# EasyEDA Pro project bldc_driver_board_easyeda_2.eprj, board PCB4
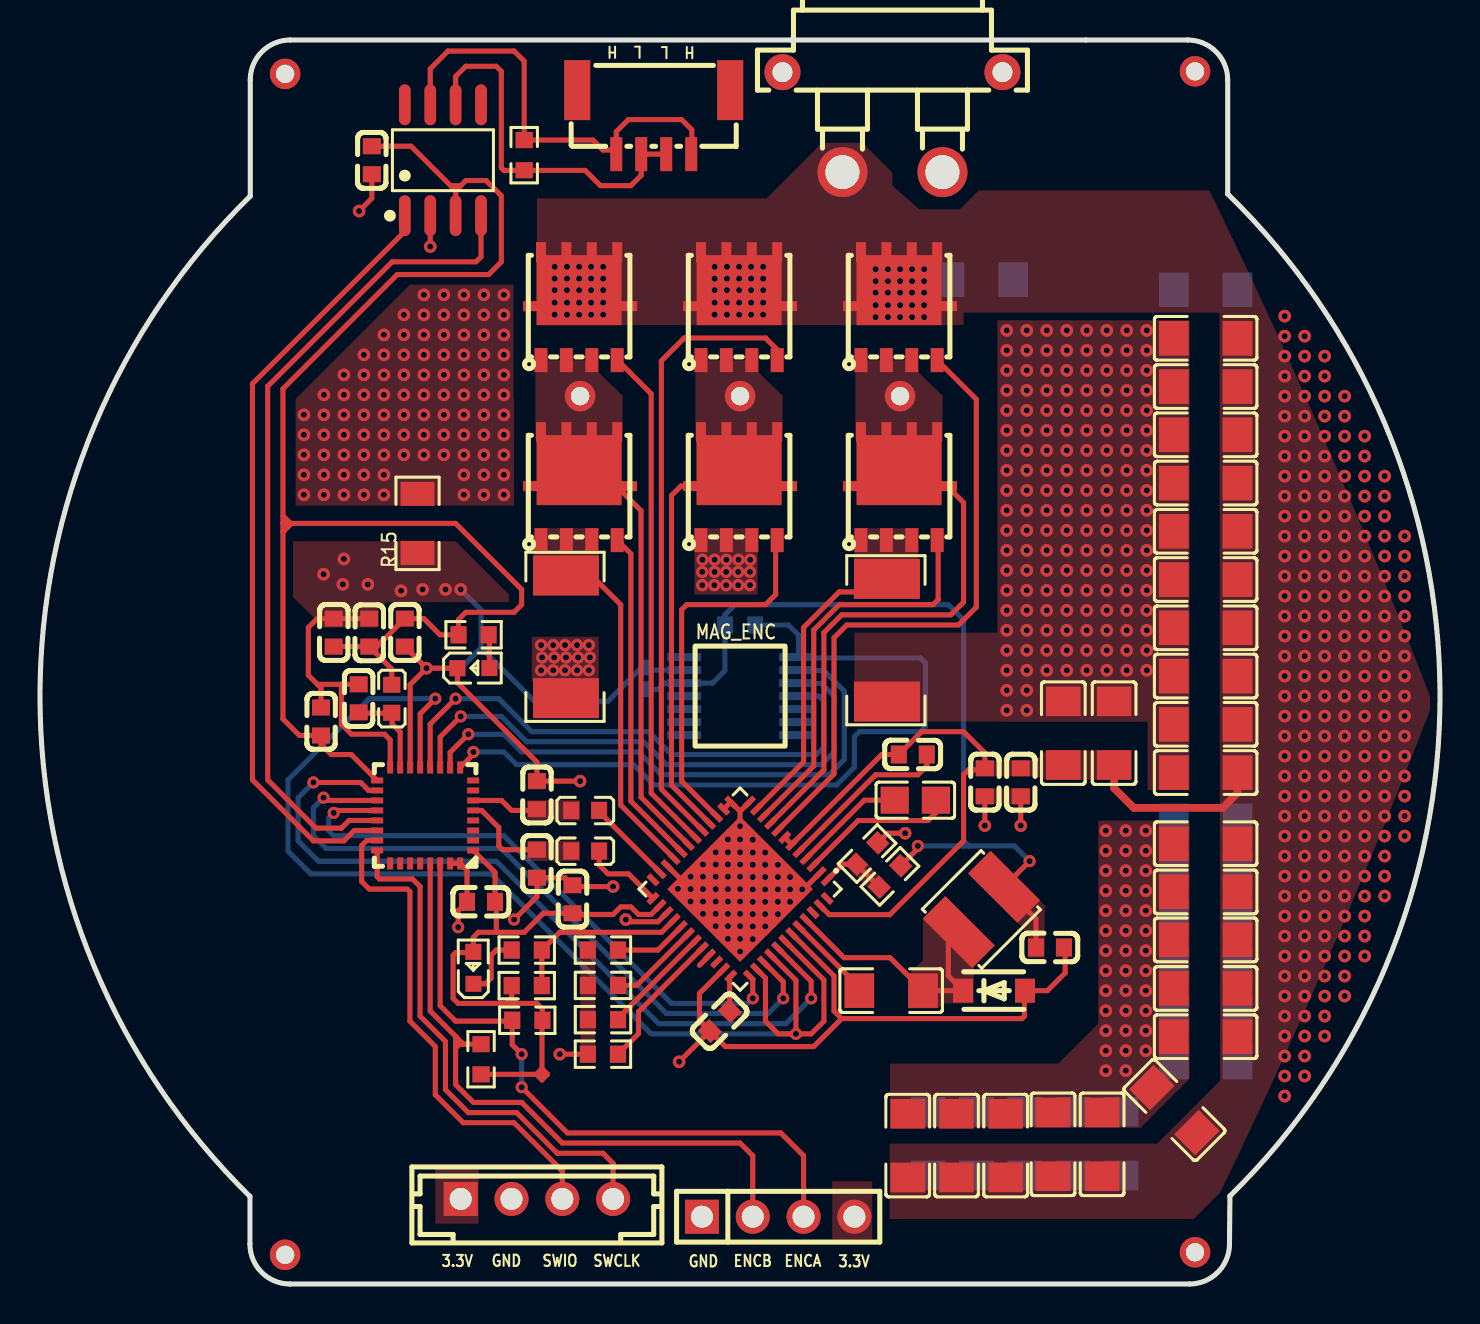
[diagram p1: board, top side]
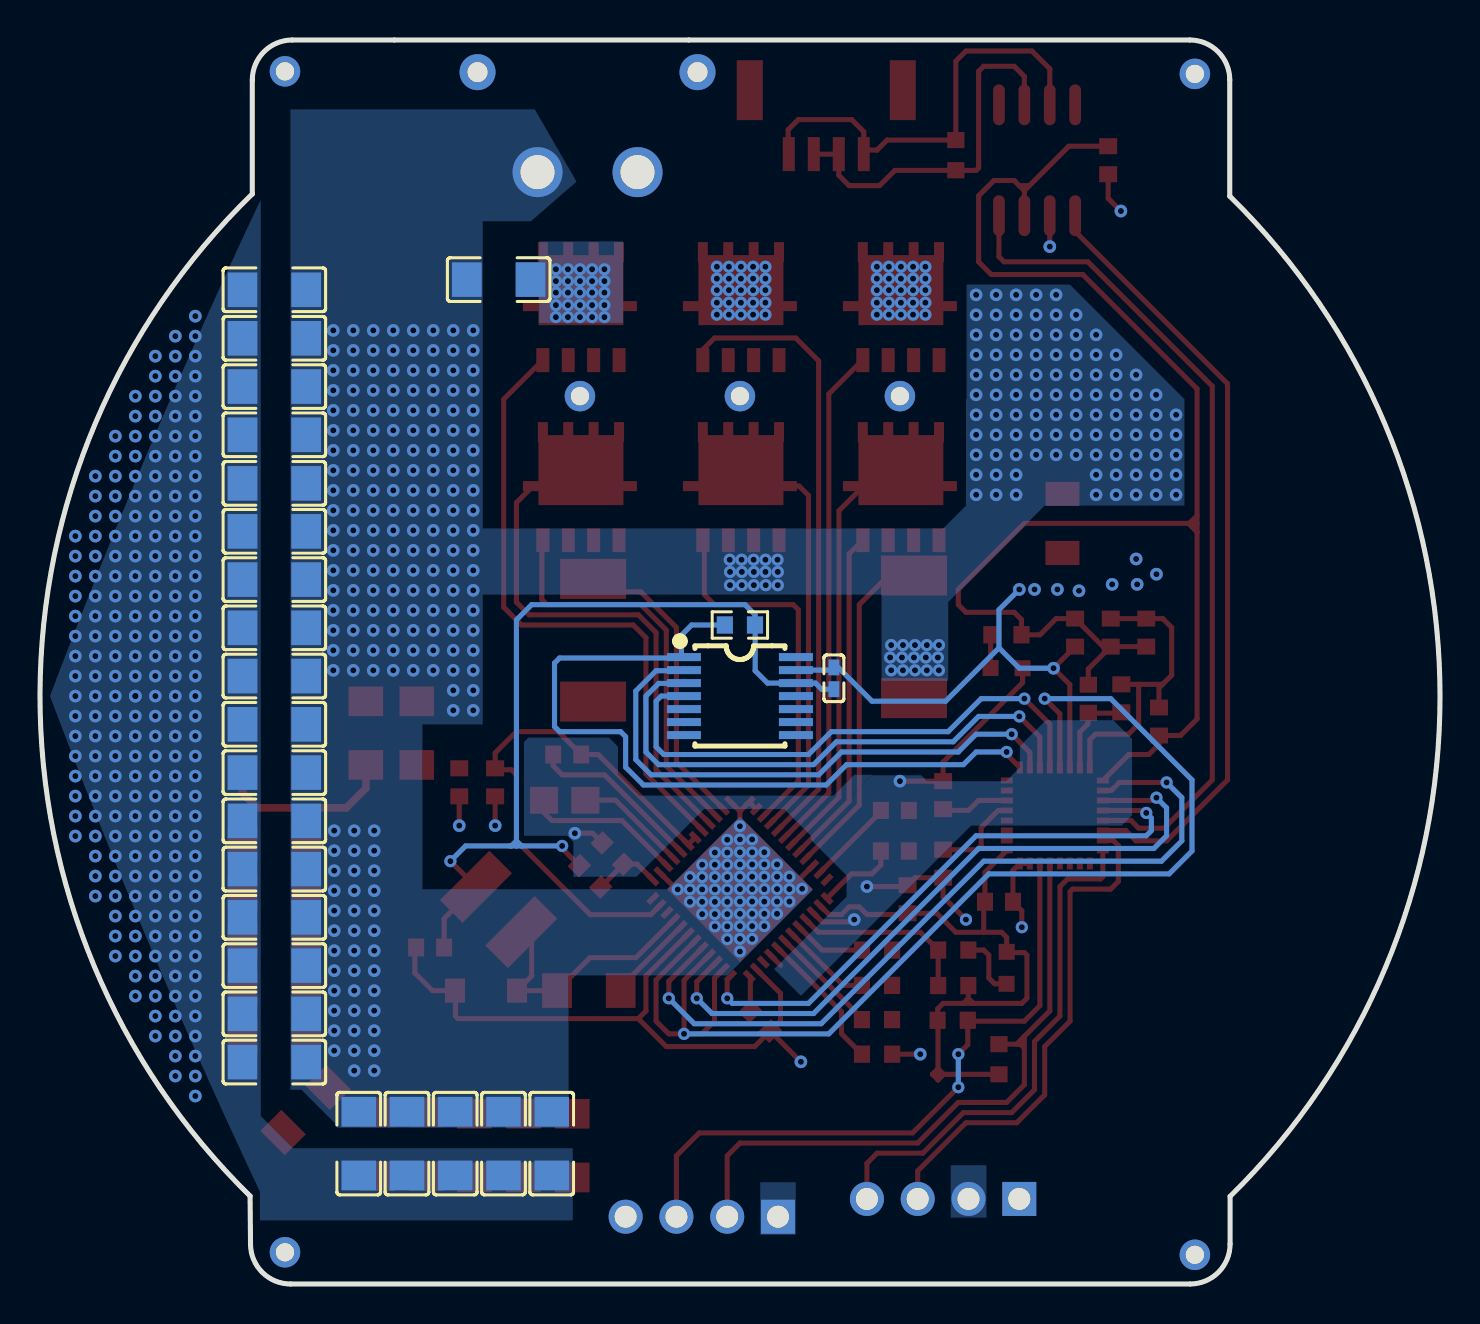
[diagram p2: board, bottom side, seen from below]

Outline 70.01 x 62.21 mm; copper layers: Top Layer, Bottom Layer. Coordinates in mm from the lower left corner of the outline.
Outline path: 10.5,4.38 10.5,2 arc(11.08,0.59) 12.5,0 57.48,0 arc(58.9,0.59) 59.48,2 59.5,4.4 arc(70.01,29.48) 59.39,54.51 59.39,60.21 arc(58.81,61.62) 57.39,62.21 12.51,62.21 arc(11.1,61.62) 10.51,60.21 10.51,54.4 arc(0,29.39) 10.5,4.38
Stack: Top Layer 0.035mm / Dielectric1 1.51mm FR4 er 4.5 / Bottom Layer 0.035mm

## Design rules (mm)
template: JLCPCB Capability(Two Layers Board)
spacing copperThickness1oz (default): track to track 0.102, other pairs 0.152 to 0.3
spacing copperThickness2oz: track to track 0.203, other pairs 0.152 to 0.3
track width copperThickness1oz (default): min 0.127, default 0.254, max 2.54
track width copperThickness2oz: min 0.203, default 0.254, max 2.54
differential pair differentialPair (default): width min 0.127, default 0.254, max 2.54; gap min 0.152, default 0.152
via viaSize (default): diameter min 0.5, default 0.61, max 10; hole min 0.3, default 0.305, max 6.3

## Placement (name value [footprint] x y rotation side)
C1  100nF  [C0603]  22.05 19.11 0 top
C2  100nF  [C0603]  14.05 28.13 270 top
C5  47nF  [C0805]  43.77 24.19 0 top
C6  10uF  [C1206]  53.71 27.55 90 top
C7  100nF  [C1206]  51.17 27.55 90 top
C8  1uF  [C0603]  43.64 26.48 0 top
C9  100nF  [C0603]  26.63 19.24 270 top
C10  1uF  [C0603]  33.99 13.14 45 top
C11  100nF  [C1206]  42.56 14.67 180 top
C12  22uF  [C0603]  50.5 16.83 0 top
C13  1uF  [C0603]  47.25 25.09 270 top
C14  1uF  [C0603]  49.04 25.09 270 top
C15  10uF  [C1206]  56.72 8.7 315 top
C16  10uF  [C1206]  58.29 44.88 0 bottom
C17  10uF  [C1206]  47.07 50.23 180 bottom
C18  10uF  [C1206]  46.83 7.02 270 bottom
C19  10uF  [C1206]  51.66 7.02 270 bottom
C20  10uF  [C1206]  43.39 6.92 270 top
C21  10uF  [C1206]  58.29 14.78 0 top
C22  10uF  [C1206]  58.29 47.29 0 top
C23  10uF  [C1206]  58.29 15.92 0 bottom
C24  10uF  [C1206]  58.29 18.34 0 bottom
C25  10uF  [C1206]  58.29 25.58 0 bottom
C26  10uF  [C1206]  58.29 27.99 0 bottom
C27  10uF  [C1206]  58.29 32.81 0 bottom
C28  10uF  [C1206]  58.29 37.64 0 bottom
C29  10uF  [C1206]  58.29 44.88 0 top
C30  10uF  [C1206]  58.29 40.05 0 top
C31  10uF  [C1206]  58.29 35.23 0 top
C32  10uF  [C1206]  58.29 30.4 0 top
C33  10uF  [C1206]  58.29 25.58 0 top
C34  10uF  [C1206]  58.29 19.61 0 top
C35  10uF  [C1206]  58.29 42.47 0 bottom
C36  10uF  [C1206]  58.29 47.29 0 bottom
C37  10uF  [C1206]  44.42 7.02 270 bottom
C38  10uF  [C1206]  49.24 7.02 270 bottom
C39  10uF  [C1206]  54.07 7.02 270 bottom
C40  10uF  [C1206]  58.29 49.72 0 bottom
C41  10uF  [C1206]  58.29 12.37 0 top
C42  10uF  [C1206]  58.29 11.1 0 bottom
C43  10uF  [C1206]  58.29 13.51 0 bottom
C44  10uF  [C1206]  58.29 20.75 0 bottom
C45  10uF  [C1206]  58.29 23.16 0 bottom
C46  10uF  [C1206]  58.29 30.4 0 bottom
C47  10uF  [C1206]  58.29 35.23 0 bottom
C48  10uF  [C1206]  58.29 40.04 0 bottom
C49  10uF  [C1206]  58.29 42.47 0 top
C50  10uF  [C1206]  58.29 37.64 0 top
C51  10uF  [C1206]  58.29 32.81 0 top
C52  10uF  [C1206]  58.29 27.99 0 top
C53  10uF  [C1206]  58.29 22.02 0 top
C54  10uF  [C1206]  58.29 17.21 0 top
C55  22uF  [C0603]  16.59 56.2 90 top
C56  220nF  [C0603]  14.69 32.58 270 top
C57  10nF  [C0603]  24.85 21.02 270 top
C58  10nF  [C0603]  24.85 24.45 270 top
C59  2.2uF  [C0402]  30.31 30.29 270 bottom
C60  10uF  [C1206]  48.29 6.92 270 top
C61  10uF  [C1206]  45.83 6.92 270 top
C62  10uF  [C1206]  53.11 6.99 270 top
C63  10uF  [C1206]  50.66 6.99 270 top
CN1  A1257WR-S-4P  [CONN-SMD_A1257WR-S-4P]  30.69 58.1 180 top
D1  MBR1H100SFT3G  [SOD-123F_L2.8-W1.8-LS3.7-RD]  47.71 14.67 0 top
H2  PZ254V-11-04P  [HDR-TH_4P-P2.54-V-M]  36.91 3.37 0 top
L2  100uH  [IND-SMD_L4.0-W4.0]  47.07 18.73 45 top
LED1  LTST-C191KRKT  [LED0603-RD]  21.67 30.8 0 top
LED2  LTST-C191KRKT  [LED0603-RD]  21.67 15.81 90 top
NOREF  -  [Pad_e1307]  57.76 60.64 0 top
NOREF#2  -  [Pad_e1308]  57.76 1.59 0 top
NOREF#3  -  [Pad_e128]  43.01 44.4 0 top
NOREF#4  -  [Pad_e1309]  12.26 1.46 0 top
NOREF#5  -  [Pad_e127]  35.01 44.4 0 top
NOREF#6  -  [Pad_e1306]  12.26 60.52 0 top
NOREF#7  -  [Pad_e126]  27.01 44.4 0 top
R1  10kΩ  [R0603]  35.01 32.96 0 bottom
R4  510Ω  [R0603]  21.68 32.47 180 top
R5  10mΩ  [RES-SMD_L6.4-W3.2-R2512]  42.35 32.19 90 top
R6  10mΩ  [RES-SMD_L6.4-W3.2-R2512]  26.3 32.36 90 top
R7  10kΩ  [R0603]  24.34 14.92 180 top
R8  330Ω  [R0603]  24.34 16.7 180 top
R9  47kΩ  [R0603]  28.15 16.7 180 top
R10  47kΩ  [R0603]  28.15 11.49 180 top
R11  75kΩ  [R0603]  28.15 13.22 180 top
R12  75kΩ  [R0603]  28.15 14.93 180 top
R13  33kΩ  [R0603]  42.5 20.38 225 top
R14  10kΩ  [R0603]  41.36 21.53 45 top
R15  0Ω  [R1206]  18.88 38.04 90 top
R16  60Ω  [R0603]  24.21 56.45 90 top
R17  10kΩ  [R0603]  24.37 13.19 180 top
R18  10kΩ  [R0603]  22.05 11.24 90 top
U1  STM32G491KEU6  [UFQFPN-32_L5.0-W5.0-P0.50-TL-1]  19.26 23.43 180 top
U2  DRV8323RHRGZR  [VQFN-48_L7.0-W7.0-P0.50-TL-EP5.1]  35.01 19.75 225 top
U3  TCAN332GD  [SOIC-8_L4.9-W3.9-P1.27-LS6.0-BL]  20.15 56.2 0 top
U4  TPH2R608NH,L1Q(M  [POWERVDFN-8_L5.0-W5.0-P1.27-LS6.0-BL]  43.01 48.9 0 top
U5  TPH2R608NH,L1Q(M  [POWERVDFN-8_L5.0-W5.0-P1.27-LS6.0-BL]  43.01 39.9 0 top
U6  TPH2R608NH,L1Q(M  [POWERVDFN-8_L5.0-W5.0-P1.27-LS6.0-BL]  35.01 48.9 0 top
U7  TPH2R608NH,L1Q(M  [POWERVDFN-8_L5.0-W5.0-P1.27-LS6.0-BL]  35.01 39.9 0 top
U8  TPH2R608NH,L1Q(M  [POWERVDFN-8_L5.0-W5.0-P1.27-LS6.0-BL]  27.01 48.9 0 top
U9  TPH2R608NH,L1Q(M  [POWERVDFN-8_L5.0-W5.0-P1.27-LS6.0-BL]  27.01 39.9 0 top
U10  100nF  [C0603]  15.94 29.29 90 top
U11  100nF  [C0603]  16.47 32.58 90 top
U12  100nF  [C0603]  18.24 32.58 270 top
U13  1uH  [L0603]  17.59 29.27 270 top
U14  1uH  [L0603]  27.26 21.65 180 top
U15  1uH  [L0603]  27.26 23.69 180 top
U18  AS5048A-HTSP-500  [TSSOP-14_L5.0-W4.4-P0.65-LS6.4-BL]  35.01 29.4 270 bottom
U19  XT30PW-F  [CONN-TH_XT30PW-F-1]  42.63 58.1 180 top
U20  B4B-EH-A(LF)(SN)  [CONN-TH_B4B-EH-A-LF-SN]  24.85 4.25 0 top

## Footprints (pads in the part's own frame, mm; a bottom-side part is the same pattern mirrored in y, then rotated)
C0402
  rect 0.79x0.54 smd: 1(-0.545,0) 2(0.545,0)
C0603
  rect 0.8x0.9 smd: 1(-0.7,0) 2(0.7,0)
C0805
  rect 1.41x1.35 smd: 1(-1.03,0) 2(1.03,0)
C1206
  rect 1.485x1.728 smd: 1(-1.593,0) 2(1.593,0)
CONN-SMD_A1257WR-S-4P
  rect 0.6x1.7 smd: 1(1.875,1.6) 2(0.625,1.6) 3(-0.625,1.6) 4(-1.875,1.6)
  rect 1.3x3 smd: 5(3.825,-1.6) 6(-3.825,-1.6)
CONN-TH_B4B-EH-A-LF-SN
  rect 1.7x1.7 hole 1.1: 1(-3.81,0)
  round 1.7 hole 1.1: 2(-1.27,0) 3(1.27,0) 4(3.81,0)
CONN-TH_XT30PW-F-1
  round 2.5 hole 1.7: 1(-2.5,2.5) 2(2.5,2.5)
  round 1.8 hole 1: 3(5.5,-2.5) 4(-5.5,-2.5)
HDR-TH_4P-P2.54-V-M
  rect 1.7x1.7 hole 1.1: 1(-3.81,0)
  round 1.7 hole 1.1: 2(-1.27,0) 3(1.27,0) 4(3.81,0)
IND-SMD_L4.0-W4.0
  rect 1.6x3.5 smd: 1(-1.6,0) 2(1.6,0)
L0603
  rect 0.8x0.864 smd: 1(-0.7,0) 2(0.7,0)
LED0603-RD
  rect 0.8x0.8 smd: 1(-0.799,-0.004) 2(0.799,0.004)
Pad_e126
  round 1.524 hole 0.914: 50(0,0)
Pad_e127
  round 1.524 hole 0.914: 51(0,0)
Pad_e128
  round 1.524 hole 0.914: 52(0,0)
Pad_e1306
  round 1.524 hole 0.914: 53(0,0)
Pad_e1307
  round 1.524 hole 0.914: 54(0,0)
Pad_e1308
  round 1.524 hole 0.914: 55(0,0)
Pad_e1309
  round 1.524 hole 0.914: 56(0,0)
POWERVDFN-8_L5.0-W5.0-P1.27-LS6.0-BL
  rect 0.65x1.2 smd: 1(-1.955,-2.7) 2(-0.685,-2.7) 3(0.585,-2.7) 4(1.855,-2.7)
  rect 0.5x1 smd: 5(1.855,2.7) 6(0.585,2.7) 7(-0.685,2.7) 8(-1.955,2.7)
  rect 1x0.5 smd: 8(-2.35,0.001) 8(2.35,0.001)
  rect 4.25x3.5 smd: 8(-0.05,0.8)
R0603
  rect 0.806x0.864 smd: 1(-0.753,0) 2(0.753,0)
R1206
  rect 1.208x1.701 smd: 1(-1.479,0) 2(1.479,0)
RES-SMD_L6.4-W3.2-R2512
  rect 2x3.3 smd: 1(-3.067,0) 2(3.067,0)
SOD-123F_L2.8-W1.8-LS3.7-RD
  rect 1x1.2 smd: 1(-1.55,0) 2(1.55,0)
SOIC-8_L4.9-W3.9-P1.27-LS6.0-BL
  oval 0.588x2.045 smd: 1(-1.905,-2.772) 2(-0.635,-2.772) 3(0.635,-2.772) 4(1.905,-2.772) 5(1.905,2.772) 6(0.635,2.772) 7(-0.635,2.772) 8(-1.905,2.772)
TSSOP-14_L5.0-W4.4-P0.65-LS6.4-BL
  rect 0.4x1.7 smd: 1(-1.95,-2.8) 2(-1.3,-2.8) 3(-0.65,-2.8) 4(0,-2.8) 5(0.65,-2.8) 6(1.3,-2.8) 7(1.95,-2.8) 8(1.95,2.8) 9(1.3,2.8) 10(0.65,2.8) 11(0,2.8) 12(-0.65,2.8) 13(-1.3,2.8) 14(-1.95,2.8)
UFQFPN-32_L5.0-W5.0-P0.50-TL-1
  rect 0.6x0.3 smd: 1(-2.4,1.75) 2(-2.4,1.25) 3(-2.4,0.75) 4(-2.4,0.25) 5(-2.4,-0.25) 6(-2.4,-0.75) 7(-2.4,-1.25) 8(-2.4,-1.75) 17(2.4,-1.75) 18(2.4,-1.25) 19(2.4,-0.75) 20(2.4,-0.25) 21(2.4,0.25) 22(2.4,0.75) 23(2.4,1.25) 24(2.4,1.75)
  rect 0.3x0.6 smd: 9(-1.75,-2.4) 10(-1.25,-2.4) 11(-0.75,-2.4) 12(-0.25,-2.4) 13(0.25,-2.4) 14(0.75,-2.4) 15(1.25,-2.4) 16(1.75,-2.4) 25(1.75,2.4) 26(1.25,2.4) 27(0.75,2.4) 28(0.25,2.4) 29(-0.25,2.4) 30(-0.75,2.4) 31(-1.25,2.4) 32(-1.75,2.4)
VQFN-48_L7.0-W7.0-P0.50-TL-EP5.1
  rect 0.665x0.28 smd: 1(-3.408,2.75) 2(-3.408,2.25) 3(-3.407,1.75) 4(-3.408,1.25) 5(-3.407,0.75) 6(-3.408,0.25) 7(-3.408,-0.25) 8(-3.407,-0.75) 9(-3.408,-1.25) 10(-3.407,-1.75) 11(-3.408,-2.25) 12(-3.408,-2.75) 25(3.408,-2.75) 26(3.408,-2.25) 27(3.407,-1.75) 28(3.408,-1.25) 29(3.407,-0.75) 30(3.408,-0.25) 31(3.408,0.25) 32(3.407,0.75) 33(3.408,1.25) 34(3.407,1.75) 35(3.408,2.25) 36(3.408,2.75)
  rect 0.28x0.665 smd: 13(-2.75,-3.408) 14(-2.25,-3.408) 15(-1.75,-3.407) 16(-1.25,-3.408) 17(-0.75,-3.407) 18(-0.25,-3.408) 19(0.25,-3.408) 20(0.75,-3.407) 21(1.25,-3.408) 22(1.75,-3.407) 23(2.25,-3.408) 24(2.75,-3.408) 37(2.75,3.408) 38(2.25,3.408) 39(1.75,3.407) 40(1.25,3.408) 41(0.75,3.407) 42(0.25,3.408) 43(-0.25,3.408) 44(-0.75,3.407) 45(-1.25,3.408) 46(-1.75,3.407) 47(-2.25,3.408) 48(-2.75,3.408)
  rect 5.15x5.15 smd: 49(0,0)

## Nets
As in the schematic, except:
BAT-: C6.2 C7.2 C15.1 C16.1 C17.1 C18.1 C19.1 C20.1 C21.1 C22.1 C23.1 C24.1 C25.1 C26.1 C27.1 C28.1 C29.1 C30.1 C31.1 C32.1 C33.1 C34.1 C35.1 C36.1 C37.1 C38.1 C39.1 C40.1 C41.1 C42.1 C43.1 C44.1 C45.1 C46.1 C47.1 C48.1 C49.1 C50.1 C51.1 C52.1 C53.1 C54.1 C60.1 C61.1 C62.1 C63.1 R5.1 R6.1 R15.2 U2.2 U2.12 U2.13 U2.14 U2.22 U2.49 U7.1 U7.2 U7.3 U19.1
PHASEA: NOREF#3.52 U2.9 U4.1 U4.2 U4.3 U5.5 U5.6 U5.7 U5.8
PHASEB: NOREF#5.51 U2.16 U6.1 U6.2 U6.3 U7.5 U7.6 U7.7 U7.8
PHASEC: NOREF#7.50 U2.19 U8.1 U8.2 U8.3 U9.5 U9.6 U9.7 U9.8

Pads without a net: CN1 5 6; NOREF 54; NOREF#2 55; NOREF#4 56; NOREF#6 53; U1 2 3 4 7 8 25 27 28; U2 46 48; U3 5 8; U18 5 6 7 8 9 10 11 14; U19 3 4

## Via types
v1: diameter 0.634, hole 0.305, Top Layer to Bottom Layer, 509 vias
v2: diameter 0.61, hole 0.305, Top Layer to Bottom Layer, 171 vias
v3: diameter 0.61, hole 0.3, Top Layer to Bottom Layer, 13 vias

## Routing (per net, layer and track width the routed paths; a pad name or vN(x,y) marks a point on that pad's centre or on a via; arc(x,y) is an arc through that point)
3.3V: length 156.6
  Top Layer w0.254: 12.15,38.42 12.53,38.04 12.58,38.04 12.15,37.6 12.15,37.59 ; 20.53,54.93 21.04,54.93 21.05,54.94 ; 23.59,14.29 23.84,14.03 23.87,14.03 ; 23.59,14.29 R7.2 ; 23.59,14.29 23.33,14.03 ; 24.77,10.49 24.82,10.49 ; 24.82,10.49 25.1,10.77 25.38,10.49 ; 24.82,10.49 25.1,10.21 25.1,10.21 25.38,10.49 ; 25.38,10.49 25.38,10.49 ; 20.78,54.67 U3.3 ; 20.78,54.67 18.56,56.9 C55.2 ; 20.78,54.67 21.29,55.18 22.31,55.18 23.07,54.42 23.07,51.12 22.43,50.48 17.86,50.48 12.15,44.77 12.15,38.04 ; U1.1 22.75,20.59 C1.2 22.82,19.05 22.82,17.59 ; U11.1 17.59,30.75 U13.1 ; U11.1 C56.2 ; U11.1 16.84,31.88 U12.1 19.19,33.28 20,32.47 R4.2 20.93,33.23 21.29,33.59 23.7,33.59 24.09,33.97 24.09,34.73 20.78,38.04 12.15,38.04 ; 33.48,16.46 33.48,16.44 32.98,15.94 ; 12.15,38.04 12.15,28.26 12.97,27.43 C2.2 14.05,26.99 14.56,26.48 15.56,26.48 U1.17 ; C12.1 49.8,18.27 L2.2 v2(49.49,21.15) ; 22.82,17.59 24.21,17.59 25.16,18.54 C9.2 26.69,18.48 28.66,18.48 29.04,18.86 29.55,18.86 29.93,18.48 30.56,18.48 U2.26 ; 22.82,17.59 21.92,17.59 21.67,17.34 LED2.2 21.63,16.57 20.78,16.57 20.66,16.45 20.66,14.29 20.91,14.03 23.33,14.03 ; R18.1 25.1,10.49 25.1,13.17 R17.1 25.12,13.76 24.85,14.03 23.33,14.03 ; v2(43.9,21.91) 43.9,21.78 R13.1
  Bottom Layer w0.254: 45.82,21.91 45.93,21.91 46.18,22.16 46.44,21.91 46.53,21.91 ; 46.18,21.91 46.18,21.91 46.18,33.21 45.42,33.97 34.75,33.97 34.25,33.47 R1.1 34.25,32.95 34.25,30.67 33.63,30.05 U18.12 31.23,30.05 30.92,29.74 C59.2 ; 46.18,21.91 48.72,21.91 v2(49.49,21.15) ; 46.18,21.91 v2(43.9,21.91)
3.3VA: length 4.6
  Top Layer w0.254: U1.15 18.01,27.6 17.61,28 17.61,28.55 ; 17.61,28.55 15.98,28.55 U10.1 ; 17.61,28.55 U13.2
24V: length 36.2
  Top Layer w0.254: U2.47 39.47,18.47 42.49,18.47 46.18,22.16 46.18,25.46 46.44,25.72 47.18,25.72 C13.1 47.25,26.56 46.18,27.62 44.09,27.62 C8.1 42.09,26.48 U2.6 U2.7
  Top Layer w0.381: C33.2 59.88,24.56 59.14,23.81 54.69,23.81 53.71,24.79 C6.1
  vias: v1(62.24,48.4) v1(62.24,47.4) v1(62.24,46.4) v1(62.24,45.4) v1(62.24,44.4) v1(62.24,43.4) v1(62.24,42.4) v1(62.24,41.4) v1(62.24,40.4) v1(62.24,39.4) v1(62.24,38.4) v1(62.24,37.4) v1(62.24,36.4) v1(62.24,35.4) v1(62.24,34.4) v1(62.24,33.4) v1(62.24,32.4) v1(62.24,31.4) v1(62.24,30.4) v1(62.24,29.4) v1(62.24,28.4) v1(62.24,27.4) v1(62.24,26.4) v1(62.24,25.4) v1(62.24,24.4) v1(62.24,23.4) v1(62.24,22.4) v1(62.24,21.4) v1(62.24,20.4) v1(62.24,19.4) v1(62.24,18.4) v1(62.24,17.4) v1(62.24,16.4) v1(62.24,15.4) v1(62.24,14.4) v1(62.24,13.4) v1(62.24,12.4) v1(62.24,11.4) v1(62.24,10.4) v1(62.24,9.4) v1(63.24,47.4) v1(63.24,46.4) v1(63.24,45.4) v1(63.24,44.4) v1(63.24,43.4) v1(63.24,42.4) v1(63.24,41.4) v1(63.24,40.4) v1(63.24,39.4) v1(63.24,38.4) v1(63.24,37.4) v1(63.24,36.4) v1(63.24,35.4) v1(63.24,34.4) v1(63.24,33.4) v1(63.24,32.4) v1(63.24,31.4) v1(63.24,30.4) v1(63.24,29.4) v1(63.24,28.4) v1(63.24,27.4) v1(63.24,26.4) v1(63.24,25.4) v1(63.24,24.4) v1(63.24,23.4) v1(63.24,22.4) v1(63.24,21.4) v1(63.24,20.4) v1(63.24,19.4) v1(63.24,18.4) v1(63.24,17.4) v1(63.24,16.4) v1(63.24,15.4) v1(63.24,14.4) v1(63.24,13.4) v1(63.24,12.4) v1(63.24,11.4) v1(63.24,10.4) v1(64.24,46.4) v1(64.24,45.4) v1(64.24,44.4) v1(64.24,43.4) v1(64.24,42.4) v1(64.24,41.4) v1(64.24,40.4) v1(64.24,39.4) v1(64.24,38.4) v1(64.24,37.4) v1(64.24,36.4) v1(64.24,35.4) v1(64.24,34.4) v1(64.24,33.4) v1(64.24,32.4) v1(64.24,31.4) v1(64.24,30.4) v1(64.24,29.4) v1(64.24,28.4) v1(64.24,27.4) v1(64.24,26.4) v1(64.24,25.4) v1(64.24,24.4) v1(64.24,23.4) v1(64.24,22.4) v1(64.24,21.4) v1(64.24,20.4) v1(64.24,19.4) v1(64.24,18.4) v1(64.24,17.4) v1(64.24,16.4) v1(64.24,15.4) v1(64.24,14.4) v1(64.24,13.4) v1(64.24,12.4) v1(65.24,44.4) v1(65.24,43.4) v1(65.24,42.4) v1(65.24,41.4) v1(65.24,40.4) v1(65.24,39.4) v1(65.24,38.4) v1(65.24,37.4) v1(65.24,36.4) v1(65.24,35.4) v1(65.24,34.4) v1(65.24,33.4) v1(65.24,32.4) v1(65.24,31.4) v1(65.24,30.4) v1(65.24,29.4) v1(65.24,29.4) v1(65.24,28.4) v1(65.24,27.4) v1(65.24,26.4) v1(65.24,25.4) v1(65.24,24.4) v1(65.24,23.4) v1(65.24,22.4) v1(65.24,21.4) v1(65.24,20.4) v1(65.24,19.4) v1(65.24,18.4) v1(65.24,17.4) v1(65.24,16.4) v1(65.24,15.4) v1(65.24,14.4) v1(66.24,42.4) v1(66.24,41.4) v1(66.24,40.4) v1(66.24,39.4) v1(66.24,38.4) v1(66.24,37.4) v1(66.24,36.4) v1(66.24,35.4) v1(66.24,34.4) v1(66.24,33.4) v1(66.24,32.4) v1(66.24,31.4) v1(66.24,30.4) v1(66.24,29.4) v1(66.24,28.4) v1(66.24,27.4) v1(66.24,26.4) v1(66.24,25.4) v1(66.24,24.4) v1(66.24,23.4) v1(66.24,22.4) v1(66.24,21.4) v1(66.24,20.4) v1(66.24,19.4) v1(66.24,18.4) v1(66.24,17.4) v1(66.24,16.4) v1(67.24,40.4) v1(67.24,39.4) v1(67.24,38.4) v1(67.24,37.4) v1(67.24,36.4) v1(67.24,35.4) v1(67.24,34.4) v1(67.24,33.4) v1(67.24,32.4) v1(67.24,31.4) v1(67.24,30.4) v1(67.24,29.4) v1(67.24,28.4) v1(67.24,27.4) v1(67.24,26.4) v1(67.24,25.4) v1(67.24,24.4) v1(67.24,23.4) v1(67.24,22.4) v1(67.24,21.4) v1(67.24,20.4) v1(67.24,19.4) v1(68.24,37.4) v1(68.24,36.4) v1(68.24,35.4) v1(68.24,34.4) v1(68.24,33.4) v1(68.24,32.4) v1(68.24,31.4) v1(68.24,30.4) v1(68.24,29.4) v1(68.24,28.4) v1(68.24,27.4) v1(68.24,26.4) v1(68.24,25.4) v1(68.24,24.4) v1(68.24,23.4) v1(68.24,22.4) v2(25.73,50.87) v2(25.73,50.28) v2(25.73,49.7) v2(25.73,49.07) v2(25.73,48.48) v2(26.35,50.87) v2(26.35,50.28) v2(26.35,49.7) v2(26.35,49.07) v2(26.35,48.48) v2(26.96,50.87) v2(26.96,50.28) v2(26.96,49.7) v2(26.96,49.07) v2(26.96,48.48) v2(27.56,50.87) v2(27.56,50.28) v2(27.56,49.7) v2(27.56,49.07) v2(27.56,48.48) v2(28.16,50.87) v2(28.16,50.28) v2(28.16,49.7) v2(28.16,49.07) v2(28.16,48.48) v2(33.73,50.87) v2(33.73,50.28) v2(33.73,49.7) v2(33.73,49.07) v2(33.73,48.48) v2(34.35,50.87) v2(34.35,50.28) v2(34.35,49.7) v2(34.35,49.07) v2(34.35,48.48) v2(34.96,50.87) v2(34.96,50.28) v2(34.96,49.7) v2(34.96,49.07) v2(34.96,48.48) v2(35.56,50.87) v2(35.56,50.28) v2(35.56,49.7) v2(35.56,49.07) v2(35.56,48.48) v2(36.16,50.87) v2(36.16,50.28) v2(36.16,49.7) v2(36.16,49.07) v2(36.16,48.48) v2(41.78,50.75) v2(41.78,50.15) v2(41.78,49.58) v2(41.78,48.95) v2(41.78,48.35) v2(42.4,50.75) v2(42.4,50.15) v2(42.4,49.58) v2(42.4,48.95) v2(42.4,48.35) v2(43.01,50.75) v2(43.01,50.15) v2(43.01,49.58) v2(43.01,48.95) v2(43.01,48.35) v2(43.61,50.75) v2(43.61,50.15) v2(43.61,49.58) v2(43.61,48.95) v2(43.61,48.35) v2(44.21,50.75) v2(44.21,50.15) v2(44.21,49.58) v2(44.21,48.95) v2(44.21,48.35)
DVDD: length 1.8
  Top Layer w0.254: 34.49,13.64 34.49,15.34 U2.36
GND: length 107.4
  Top Layer w0.254: v2(23.7,18.22) 24.85,19.37 C57.2 26.25,20.32 C9.1 26.69,19.88 v1(28.66,19.88) ; C55.1 16.59,54.29 v1(15.96,53.66) ; 33.5,12.65 32.98,13.17 32.98,14.53 U2.35 ; 33.5,12.65 34.27,11.87 38.69,11.87 40.09,13.27 ; 33.5,12.65 v1(31.96,11.11) ; 15.03,29.99 15.07,29.94 15.07,28 15.58,27.5 17.23,27.5 17.51,27.21 U1.16 ; 15.03,29.99 U10.2 ; 15.03,29.99 13.87,29.99 ; v1(43.26,22.54) 42.37,22.54 R14.2 ; 40.09,13.27 39.71,13.65 39.71,15.4 U2.43 ; 40.09,13.27 49.1,13.27 49.23,13.4 49.23,14.64 D1.2 50.37,14.67 51.26,15.56 51.26,16.77 C12.2 ; v1(27.01,25.15) C58.1 24.85,26.1 20.87,30.07 LED1.1 v1(19.33,30.79) ; C14.2 v1(49.04,22.92) ; v2(20.91,17.84) 20.91,18.67 C1.1 21.35,20.69 U1.32 U1.31 ; v1(19.51,51.88) U3.2 ; 13.87,29.99 14.05,29.81 C2.1 ; 13.87,29.99 13.42,30.44 13.42,32.83 13.86,33.28 C56.1 U11.2 ; v1(19.33,30.79) U12.2 ; v1(19.33,30.79) 18.51,29.98 U1.14 ; v1(29.29,18.22) 29.4,18.12 30.9,18.12 31.36,18.58 ; R10.2 v1(25.99,11.49) ; C13.2 v1(47.25,22.92)
  Bottom Layer w0.254: 22.05,31.81 21.03,30.79 v1(19.33,30.79) ; 22.05,31.81 24.72,29.15 28.4,29.15 30.09,30.83 C59.1 30.44,30.7 U18.13 ; 22.05,31.81 22.05,33.72 v1(21.04,34.73)
  vias: v1(14.18,35.5) v1(15.14,34.99) v1(15.2,36.26) v1(16.39,34.99) v1(18.05,34.67) v1(19.13,34.73) v1(20.28,34.73)
BAT-: length 10.9
  Top Layer w0.254: 38.13,19.75 38.19,19.75 38.93,20.49 ; U2.14 U2.13 35.01,23.64 ; U2.12 35.01,23.64 ; 35.01,23.64 v3(35.01,22.9) v3(35.01,22.23) v3(35.01,21.59) v3(35.01,20.98) v3(35.01,20.37) v3(35.01,19.75) v2(34.4,19.75) v2(33.79,19.75) v2(33.15,19.75) v2(32.53,19.75) 31.36,20.92
  vias: v1(13.2,43.47) v1(13.2,42.47) v1(13.2,41.47) v1(13.2,40.47) v1(13.2,39.47) v1(14.2,44.47) v1(14.2,43.47) v1(14.2,42.47) v1(14.2,41.47) v1(14.2,40.47) v1(14.2,39.47) v1(15.2,45.47) v1(15.2,44.47) v1(15.2,43.47) v1(15.2,42.47) v1(15.2,41.47) v1(15.2,40.47) v1(15.2,39.47) v1(16.2,46.47) v1(16.2,45.47) v1(16.2,44.47) v1(16.2,43.47) v1(16.2,42.47) v1(16.2,41.47) v1(16.2,40.47) v1(16.2,39.47) v1(17.2,47.47) v1(17.2,46.47) v1(17.2,45.47) v1(17.2,44.47) v1(17.2,43.47) v1(17.2,42.47) v1(17.2,41.47) v1(17.2,40.47) v1(17.2,39.47) v1(18.2,48.47) v1(18.2,47.47) v1(18.2,46.47) v1(18.2,45.47) v1(18.2,44.47) v1(18.2,43.47) v1(18.2,42.47) v1(18.2,41.47) v1(19.2,49.47) v1(19.2,48.47) v1(19.2,47.47) v1(19.2,46.47) v1(19.2,45.47) v1(19.2,44.47) v1(19.2,43.47) v1(19.2,42.47) v1(19.2,41.47) v1(20.2,49.47) v1(20.2,48.47) v1(20.2,47.47) v1(20.2,46.47) v1(20.2,45.47) v1(20.2,44.47) v1(20.2,43.47) v1(20.2,42.47) v1(20.2,41.47) v1(21.2,49.47) v1(21.2,48.47) v1(21.2,47.47) v1(21.2,46.47) v1(21.2,45.47) v1(21.2,44.47) v1(21.2,43.47) v1(21.2,42.47) v1(21.2,41.47) v1(21.2,40.47) v1(21.2,39.47) v1(22.2,49.47) v1(22.2,48.47) v1(22.2,47.47) v1(22.2,46.47) v1(22.2,45.47) v1(22.2,44.47) v1(22.2,43.47) v1(22.2,42.47) v1(22.2,41.47) v1(22.2,40.47) v1(22.2,39.47) v1(23.2,49.47) v1(23.2,48.47) v1(23.2,47.47) v1(23.2,46.47) v1(23.2,45.47) v1(23.2,44.47) v1(23.2,43.47) v1(23.2,42.47) v1(23.2,41.47) v1(23.2,40.47) v1(23.2,39.47) v1(48.34,47.69) v1(48.34,46.69) v1(48.34,45.69) v1(48.34,44.69) v1(48.34,43.69) v1(48.34,42.69) v1(48.34,41.69) v1(48.34,40.69) v1(48.34,39.69) v1(48.34,38.69) v1(48.34,37.69) v1(48.34,36.69) v1(48.34,35.69) v1(48.34,34.69) v1(48.34,33.69) v1(48.34,32.69) v1(48.34,31.69) v1(48.34,30.69) v1(48.34,29.69) v1(48.34,28.69) v1(49.34,47.69) v1(49.34,46.69) v1(49.34,45.69) v1(49.34,44.69) v1(49.34,43.69) v1(49.34,42.69) v1(49.34,41.69) v1(49.34,40.69) v1(49.34,39.69) v1(49.34,38.69) v1(49.34,37.69) v1(49.34,36.69) v1(49.34,35.69) v1(49.34,34.69) v1(49.34,33.69) v1(49.34,32.69) v1(49.34,31.69) v1(49.34,30.69) v1(49.34,29.69) v1(49.34,28.69) v1(50.34,47.69) v1(50.34,46.69) v1(50.34,45.69) v1(50.34,44.69) v1(50.34,43.69) v1(50.34,42.69) v1(50.34,41.69) v1(50.34,40.69) v1(50.34,39.69) v1(50.34,38.69) v1(50.34,37.69) v1(50.34,36.69) v1(50.34,35.69) v1(50.34,34.69) v1(50.34,33.69) v1(50.34,32.69) v1(50.34,31.69) v1(50.34,30.69) v1(51.34,47.69) v1(51.34,46.69) v1(51.34,45.69) v1(51.34,44.69) v1(51.34,43.69) v1(51.34,42.69) v1(51.34,41.69) v1(51.34,40.69) v1(51.34,39.69) v1(51.34,38.69) v1(51.34,37.69) v1(51.34,36.69) v1(51.34,35.69) v1(51.34,34.69) v1(51.34,33.69) v1(51.34,32.69) v1(51.34,31.69) v1(51.34,30.69) v1(52.34,47.69) v1(52.34,46.69) v1(52.34,45.69) v1(52.34,44.69) v1(52.34,43.69) v1(52.34,42.69) v1(52.34,41.69) v1(52.34,40.69) v1(52.34,39.69) v1(52.34,38.69) v1(52.34,37.69) v1(52.34,36.69) v1(52.34,35.69) v1(52.34,34.69) v1(52.34,33.69) v1(52.34,32.69) v1(52.34,31.69) v1(52.34,30.69) v1(53.34,47.69) v1(53.34,46.69) v1(53.34,45.69) v1(53.34,44.69) v1(53.34,43.69) v1(53.34,42.69) v1(53.34,41.69) v1(53.34,40.69) v1(53.34,39.69) v1(53.34,38.69) v1(53.34,37.69) v1(53.34,36.69) v1(53.34,35.69) v1(53.34,34.69) v1(53.34,33.69) v1(53.34,32.69) v1(53.34,31.69) v1(53.34,30.69) v1(53.3,22.67) v1(53.3,21.67) v1(53.3,20.67) v1(53.3,19.67) v1(53.3,18.67) v1(53.3,17.67) v1(53.3,16.67) v1(53.3,15.67) v1(53.3,14.67) v1(53.3,13.67) v1(53.3,12.67) v1(53.3,11.67) v1(53.3,10.67) v1(54.34,47.69) v1(54.34,46.69) v1(54.34,45.69) v1(54.34,44.69) v1(54.34,43.69) v1(54.34,42.69) v1(54.34,41.69) v1(54.34,40.69) v1(54.34,39.69) v1(54.34,38.69) v1(54.34,37.69) v1(54.34,36.69) v1(54.34,35.69) v1(54.34,34.69) v1(54.34,33.69) v1(54.34,32.69) v1(54.34,31.69) v1(54.34,30.69) v1(54.3,22.67) v1(54.3,21.67) v1(54.3,20.67) v1(54.3,19.67) v1(54.3,18.67) v1(54.3,17.67) v1(54.3,16.67) v1(54.3,15.67) v1(54.3,14.67) v1(54.3,13.67) v1(54.3,12.67) v1(54.3,11.67) v1(54.3,10.67) v1(55.34,47.69) v1(55.34,46.69) v1(55.34,45.69) v1(55.34,44.69) v1(55.34,43.69) v1(55.34,42.69) v1(55.34,41.69) v1(55.34,40.69) v1(55.34,39.69) v1(55.34,38.69) v1(55.34,37.69) v1(55.34,36.69) v1(55.34,35.69) v1(55.34,34.69) v1(55.34,33.69) v1(55.34,32.69) v1(55.34,31.69) v1(55.34,30.69) v1(55.3,22.67) v1(55.3,21.67) v1(55.3,20.67) v1(55.3,19.67) v1(55.3,18.67) v1(55.3,17.67) v1(55.3,16.67) v1(55.3,15.67) v1(55.3,14.67) v1(55.3,13.67) v1(55.3,12.67) v1(55.3,11.67) v2(25.06,31.95) v2(25.06,30.69) v2(25.11,31.33) v2(25.66,31.95) v2(25.71,31.33) v2(25.66,30.69) v2(26.25,31.95) v2(26.25,30.69) v2(26.3,31.33) v2(26.85,31.95) v2(26.85,30.69) v2(26.91,31.33) v2(27.45,31.95) v2(27.45,30.69) v2(27.5,31.33) v2(32.53,20.37) v2(32.53,19.12) v2(33.13,36.22) v2(33.11,35.61) v2(33.11,34.95) v2(33.15,20.98) v2(33.15,20.37) v2(33.15,19.12) v2(33.15,18.51) v2(33.73,36.22) v2(33.73,35.61) v2(33.72,34.95) v2(33.79,21.59) v2(33.79,20.98) v2(33.79,20.37) v2(33.79,19.12) v2(33.79,18.51) v2(33.79,17.9) v2(34.32,36.22) v2(34.31,35.61) v2(34.31,34.95) v2(34.4,22.23) v2(34.4,21.59) v2(34.4,20.98) v2(34.4,20.37) v2(34.4,19.12) v2(34.4,18.51) v2(34.4,17.9) v2(34.4,17.26) v2(34.93,36.22) v2(34.91,35.61) v2(34.91,34.95) v2(35.52,36.22) v2(35.5,35.61) v2(35.5,34.95) v2(35.64,22.22) v2(35.64,21.58) v2(35.64,20.97) v2(35.64,20.35) v2(35.64,19.73) v2(35.64,19.11) v2(35.64,18.5) v2(35.64,17.88) v2(35.64,17.25) v2(36.26,21.58) v2(36.26,20.97) v2(36.26,20.35) v2(36.26,19.73) v2(36.26,19.11) v2(36.26,18.5) v2(36.26,17.88) v2(36.9,20.97) v2(36.9,20.35) v2(36.9,19.73) v2(36.9,19.11) v2(36.9,18.5) v2(37.51,20.35) v2(37.51,19.73) v2(37.51,19.11) v3(31.9,19.76) v3(35.01,19.12) v3(35.01,18.51) v3(35.01,17.9) v3(35.01,17.26) v3(35.01,16.63) v3(38.12,19.73)
CANH: length 22.5
  Top Layer w0.254: U3.7 19.51,60.77 20.4,61.66 23.7,61.66 24.21,61.15 R16.2 27.65,57.2 28.15,56.71 28.61,56.71 CN1.1 28.82,57.62 29.42,58.23 32.09,58.23 32.59,57.72 32.59,56.53 CN1.4
CANL: length 18.7
  Top Layer w0.254: 24.2,55.69 R16.1 ; 24.2,55.69 27.26,55.69 28.02,54.93 29.55,54.93 30.07,55.45 CN1.2 CN1.3 ; 24.2,55.69 23.2,55.69 23.07,55.82 23.07,60.64 22.82,60.9 21.29,60.9 20.78,60.39 U3.6
CLK_MAG: length 28.3
  Top Layer w0.254: v2(21.42,27.5) 20.51,26.59 U1.10
  Bottom Layer w0.254: U18.2 37.84,30.67 39.2,30.67 40.21,29.65 40.21,26.23 39.45,25.46 31.07,25.46 29.93,26.61 24.09,26.61 23.2,27.5 v2(21.42,27.5)
CS_MAG: length 39.7
  Top Layer w0.254: v2(21.67,26.61) 21.67,26.49 U1.9
  Bottom Layer w0.254: v2(21.67,26.61) 23.2,26.61 23.83,25.97 29.67,25.97 30.69,24.96 39.83,24.96 40.72,25.84 40.72,27.37 40.98,27.62 44.02,27.62 44.28,27.88 44.28,31.05 44.02,31.31 37.85,31.31 U18.1 37.93,31.47 37.93,32.45 37.42,32.96 R1.2
ENABLE: length 61.1
  Top Layer w0.254: U1.13 19.01,28.52 v2(19.77,29.27) ; U2.42 39.2,15.2 39.2,13.14 38.56,12.51 v2(37.8,12.51) ; v2(37.8,12.51) 37.8,15.19 36.53,16.46 ; v2(37.8,12.51) 36.91,12.51 36.28,13.14 36.28,15.3 U2.38
  Bottom Layer w0.254: v2(37.8,12.51) 30.56,12.51 22.56,20.51 13.54,20.51 12.4,21.65 12.4,25.21 16.47,29.27 v2(19.77,29.27)
ENC_A: length 33.2
  Top Layer w0.254: v2(24.09,9.84) 26.37,7.56 37.04,7.56 38.18,6.41 H2.3 ; U1.30 20.01,13.92 20.78,13.14 23.57,13.14 R17.2 23.61,11.97 v2(24.09,11.49)
  Bottom Layer w0.254: v2(24.09,11.49) v2(24.09,9.84)
ENC_B: length 32.9
  Top Layer w0.254: 20.78,11.8 20.98,11.99 21.17,11.99 ; 21.17,11.99 20.79,12.38 ; 21.17,11.99 R18.2 ; 20.79,12.38 20.78,12.38 20.78,9.97 21.67,9.08 24.09,9.08 26.12,7.05 35.01,7.05 35.64,6.41 H2.2 ; 20.79,12.38 19.51,13.66 U1.29
FB: length 3.4
  Top Layer w0.254: U2.1 40.14,20.99 R14.1 R13.2
FDCAN_RX: length 41.7
  Top Layer w0.254: U1.21 15.45,23.18 15.07,22.8 13.8,22.8 11.39,25.21 11.39,44.89 17.61,51.12 21.8,51.12 22.05,51.37 U3.4
FDCAN_TX: length 39.1
  Top Layer w0.254: U1.22 15.72,22.68 15.2,22.16 13.67,22.16 10.62,25.21 10.62,45.02 18.24,52.64 U3.1
GHA: length 31.7
  Top Layer w0.254: U2.8 39.71,25.51 39.71,32.32 40.34,32.96 45.93,32.96 46.82,33.84 46.82,44.24 U4.4
GHB: length 31.4
  Top Layer w0.254: U6.4 36.86,46.72 36.28,47.31 32.21,47.31 31.07,46.16 31.07,24.75 U2.17
GHC: length 25.5
  Top Layer w0.254: U2.18 30.56,24.55 30.56,44.51 28.88,46.2 U8.4
GLA: length 20.2
  Top Layer w0.254: 36.18,23.4 38.69,25.91 38.69,32.7 39.96,33.97 44.66,33.97 44.91,34.23 44.91,37.15 U5.4
GLB: length 18.8
  Top Layer w0.254: U7.4 36.79,37.12 36.79,34.48 36.28,33.97 32.34,33.97 32.09,33.72 32.09,25.14 33.84,23.4
GLC: length 16.9
  Top Layer w0.254: U9.4 29.55,36.52 29.55,24.15 U2.20
LP_SOA: length 4.5
  Top Layer w0.254: U1.5 22.09,23.68 22.94,22.83 22.94,21.91 23.13,21.72 C57.1
LP_SOC: length 3.5
  Top Layer w0.254: 24.91,23.69 C58.2 24.79,23.69 23.58,23.69 23.08,24.18 U1.6
MISO_MAG: length 27.9
  Top Layer w0.254: U1.11 20.01,27.36 v2(21.04,28.38)
  Bottom Layer w0.254: v2(21.04,28.38) 23.07,28.38 24.34,27.11 30.18,27.11 31.32,25.97 39.07,25.97 39.71,26.61 39.71,29.4 39.07,30.04 37.82,30.04 U18.3
MOSI_MAG: length 27.5
  Top Layer w0.254: U1.12 19.51,28 v2(20.78,29.27)
  Bottom Layer w0.254: v2(20.78,29.27) 22.94,29.27 24.59,27.62 30.44,27.62 31.58,26.48 38.82,26.48 39.2,26.86 39.2,29.15 38.94,29.4 U18.4
NFAULT: length 9
  Top Layer w0.254: 31.71,18.22 31.08,17.59 25.98,17.59 R8.1 R7.1
PHASEA: length 24.4
  Top Layer w0.254: U5.8 46.18,39.07 46.18,34.1 45.55,33.46 40.09,33.46 39.2,32.58 39.2,25.71 36.53,23.04
PHASEB: length 18.5
  Top Layer w0.254: 33.48,23.04 31.58,24.94 31.58,39.43 32.05,39.9 U7.8
PHASEC: length 21.6
  Top Layer w0.254: U2.19 30.05,24.35 30.05,38.67 28.03,40.7 U9.8
PWMA: length 29.3
  Top Layer w0.254: v2(14.69,23.56) 14.81,23.68 U1.20 ; U2.37 35.64,15.22 v2(35.64,14.29)
  Bottom Layer w0.254: v2(35.64,14.29) 35.39,14.03 31.58,14.03 23.2,22.42 14.69,22.42 14.43,22.67 14.43,23.3 v2(14.69,23.56)
PWMB: length 34.6
  Top Layer w0.254: 36.18,16.1 37.17,15.11 v2(37.17,14.29) ; v2(14.18,24.32) 14.32,24.18 U1.19
  Bottom Layer w0.254: v2(14.18,24.32) 13.67,23.81 13.67,22.42 14.31,21.78 23.07,21.78 31.32,13.53 36.4,13.53 v2(37.17,14.29)
PWMC: length 39.8
  Top Layer w0.254: v2(13.67,25.08) 16.03,25.08 16.43,24.68 U1.18 ; U2.41 38.56,15.13 v2(38.56,14.29)
  Bottom Layer w0.254: v2(13.67,25.08) 12.91,24.32 12.91,22.16 13.93,21.15 22.82,21.15 30.94,13.02 37.29,13.02 v2(38.56,14.29)
SOA: length 4.1
  Top Layer w0.254: U14.1 27.96,20.95 28.4,20.51 29.43,20.51 U2.25
SOC: length 4.4
  Top Layer w0.254: U15.1 27.96,23.61 U2.23
SPA: length 15.2
  Top Layer w0.254: R5.2 41.7,34.61 39.96,34.61 38.18,32.83 38.18,26.11 U2.11
SPC: length 17.1
  Top Layer w0.254: 31.71,21.27 29.04,23.95 29.04,33.97 27.58,35.43 26.3,35.43
SWCLK: length 26
  Top Layer w0.254: U20.4 28.66,6.03 28.15,6.54 25.86,6.54 23.83,8.57 21.42,8.57 20.28,9.72 20.28,12.13 19.01,13.4 19.01,19.88 18.62,20.26 16.97,20.26 16.86,20.37 U1.24
SWIO: length 25.3
  Top Layer w0.254: U1.23 16.34,22.18 16.08,21.93 16.08,20.13 16.47,19.75 18.37,19.75 18.5,19.62 18.5,13.14 19.77,11.87 19.77,9.46 21.16,8.06 23.7,8.06 26.12,5.65 U20.3
$1N3020: length 1.7
  Top Layer w0.254: R4.1 22.47,32.43 LED1.2
$1N3116: length 7.9
  Top Layer w0.254: C5.2 44.8,23.57 44.41,23.18 40.91,23.18 38.65,20.92
$1N3119: length 5.6
  Top Layer w0.254: C5.1 41.22,24.19 38.3,21.27
$1N3348: length 8.7
  Top Layer w0.254: U2.5 41.78,25.46 43.9,25.46 44.34,25.91 C8.2
$1N4267: length 3.3
  Top Layer w0.254: R8.2 22.82,16.7 22.56,16.45 22.56,15.3 22.27,15.01 LED2.1
$1N4347: length 3.6
  Top Layer w0.254: U2.29 30.9,16.7 R9.1
$1N4386: length 7.1
  Top Layer w0.254: U2.32 29.93,13.61 29.93,12.52 R10.1
$1N4470: length 5.5
  Top Layer w0.254: U2.31 28.91,13.29 R11.1
$1N4546: length 4.6
  Top Layer w0.254: U2.30 29.84,14.93 R12.1
$1N4795: length 4.5
  Top Layer w0.254: C11.2 40.97,14.85 U2.44
$1N4956: length 13.3
  Top Layer w0.254: 46.16,14.67 D1.1 ; 46.16,14.67 45.42,15.4 45.42,18.28 45.35,18.35 ; 46.16,14.67 C11.1 42.51,16.32 40.2,16.32 38.3,18.22

## Copper pours and planes (outline as drawn; the poured copper is in the pictures)
3.3V on Top Layer: 48.6,19.47 50.25,19.47 50.25,16.32 48.6,16.32
3.3V on Top Layer: 19.77,5.85 21.93,5.85 21.93,3.01 19.77,3.01
3.3V on Top Layer: 13.68,0.57 13.67,0.58 13.67,0.57 10.88,0.57 10.88,3.37 10.9,3.37 10.9,4.72 10.88,4.72 10.88,4.74 3.21,16.03 0.51,29.4 3.21,42.77 10.88,54.06 10.88,58.86 11.51,59.5 16.72,59.5 17.1,59.12 17.1,56.71 16.97,56.58 15.39,56.58 15,56.19 15,49.65 10.52,45.18 10.52,24.83 15.58,24.83 15.58,20.51 19.64,20.51 19.64,8.95 21.93,8.95 21.93,1.84 39.58,1.84 39.58,3.08 39.68,3.17 39.6,3.17 39.6,7.94 39.47,8.06 26.63,8.06 24.97,9.72 24.97,10.61 30.06,10.61 30.44,10.99 30.44,13.54 32.98,16.08 33.48,15.58 33.48,15.56 32.46,14.53 32.46,12.12 33.09,11.49 38.94,11.49 40.21,12.76 49.61,12.76 50.5,13.65 50.5,18.42 50.91,18.83 48.72,21.02 48.72,22.32 51.61,22.32 52.53,21.4 52.53,13.27 50.64,11.37 41.61,11.37 41.61,3.37 41.55,3.3 41.61,3.24 41.61,1.08 41.1,0.57
3.3V on Top Layer: 39.61,5.14 41.61,5.14 41.61,2.09 39.61,2.09
24V on Top Layer: 49.44,26.7 54.52,26.7 54.52,25.21 49.44,25.21
24V on Top Layer: 46.74,26.17 49.53,26.17 49.53,25.41 46.74,25.41
24V on Top Layer: 24.85,57.07 69.51,57.07 69.51,3.25 24.85,3.25
24V on Bottom Layer: 40.85,52.13 45.04,52.13 45.04,48.07 40.85,48.07
24V on Bottom Layer: 43.37,54.22 69.51,54.22 69.51,3.18 43.37,3.18
GND on Top Layer: 46.74,24.77 49.53,24.77 49.53,24.01 46.74,24.01
GND on Top Layer: 12.66,37.15 23.45,37.15 23.45,32.83 12.66,32.83
GND on Top Layer: 27.02,17.08 27.77,17.08 27.77,11.07 27.02,11.07
GND on Bottom Layer: 22.68,5.94 24.47,5.94 24.47,3.32 22.68,3.32
GND on Bottom Layer: 33.99,4.25 33.99,2.51 32.24,2.51 32.24,5.62 31.32,6.54 24.59,6.54 24.47,6.67 24.47,4.16 22.68,4.16 22.68,6.56 12.75,6.56 11,4.82 11,4.72 10.95,4.77 10.9,4.72 10.9,4.81 3.24,16.06 0.51,29.4 3.21,42.79 10.9,54.08 11.47,54.5 16.85,54.5 16.85,52.77 17.35,52.26 20.53,52.26 20.53,51.12 18.88,51.12 12.27,44.51 12.27,38.29 19.64,38.29 24.09,33.84 24.09,30.54 21.04,27.5 15.07,27.5 15.07,19.88 22.56,19.88 30.56,11.87 36.53,11.87 36.53,6.79
GND on Bottom Layer: 42.95,23.43 50.63,23.43 50.63,20.33 42.95,20.33
GND on Bottom Layer: 28.4,27.32 45.8,27.32 45.8,20.36 28.4,20.36
GND on Bottom Layer: 32.21,5.09 33.99,5.09 33.99,2.46 32.21,2.46
GND on Bottom Layer: 15.41,28.19 33.29,28.19 33.29,14.41 15.41,14.41
BAT- on Top Layer: 40.72,48.2 57.49,48.2 57.49,24.7 40.72,24.7
BAT- on Top Layer: 12.78,49.97 23.7,49.97 23.7,38.93 12.78,38.93
BAT- on Top Layer: 24.59,32.36 27.94,32.36 27.94,30.16 24.59,30.16
BAT- on Top Layer: 42.5,23.18 57.49,23.18 57.49,7.81 42.5,7.81
BAT- on Top Layer: 32.72,37.79 35.9,37.79 35.9,34.48 32.72,34.48
BAT- on Bottom Layer: 12.78,58.74 57.49,58.74 57.49,7.81 12.78,7.81
FB on Top Layer: 40.2,21.53 42.54,21.53 42.54,19.26 40.2,19.26
LP_SOA on Top Layer: 24.34,22.16 27.01,22.16 27.01,21.15 24.34,21.15
LP_SOC on Top Layer: 24.34,24.19 27.01,24.19 27.01,23.18 24.34,23.18
PHASEA on Top Layer: 40.77,46.2 45.14,46.2 45.14,42.23 40.77,42.23
PHASEB on Top Layer: 32.77,46.2 37.14,46.2 37.14,42.23 32.77,42.23
PHASEC on Top Layer: 24.77,46.2 29.14,46.2 29.14,42.23 24.77,42.23
SPA on Top Layer: 40.74,37.79 43.91,37.79 43.91,35.63 40.74,35.63
SPC on Top Layer: 24.73,37.8 27.92,37.8 27.92,35.62 24.73,35.62
$1N4956 on Top Layer: 43.41,18.28 46.69,18.28 46.69,13.78 43.41,13.78

Small or netless copper shapes (teardrops, artwork), in the pictures only: 2 on Top Layer

## Text on the board
Top Silkscreen Layer: 3.3V | GND | SWIO | SWCLK | ENCB | ENCA | H | L | MAG_ENC
